# EAGLE design KGGR_M2_MOS (EAGLE 9.4.2)
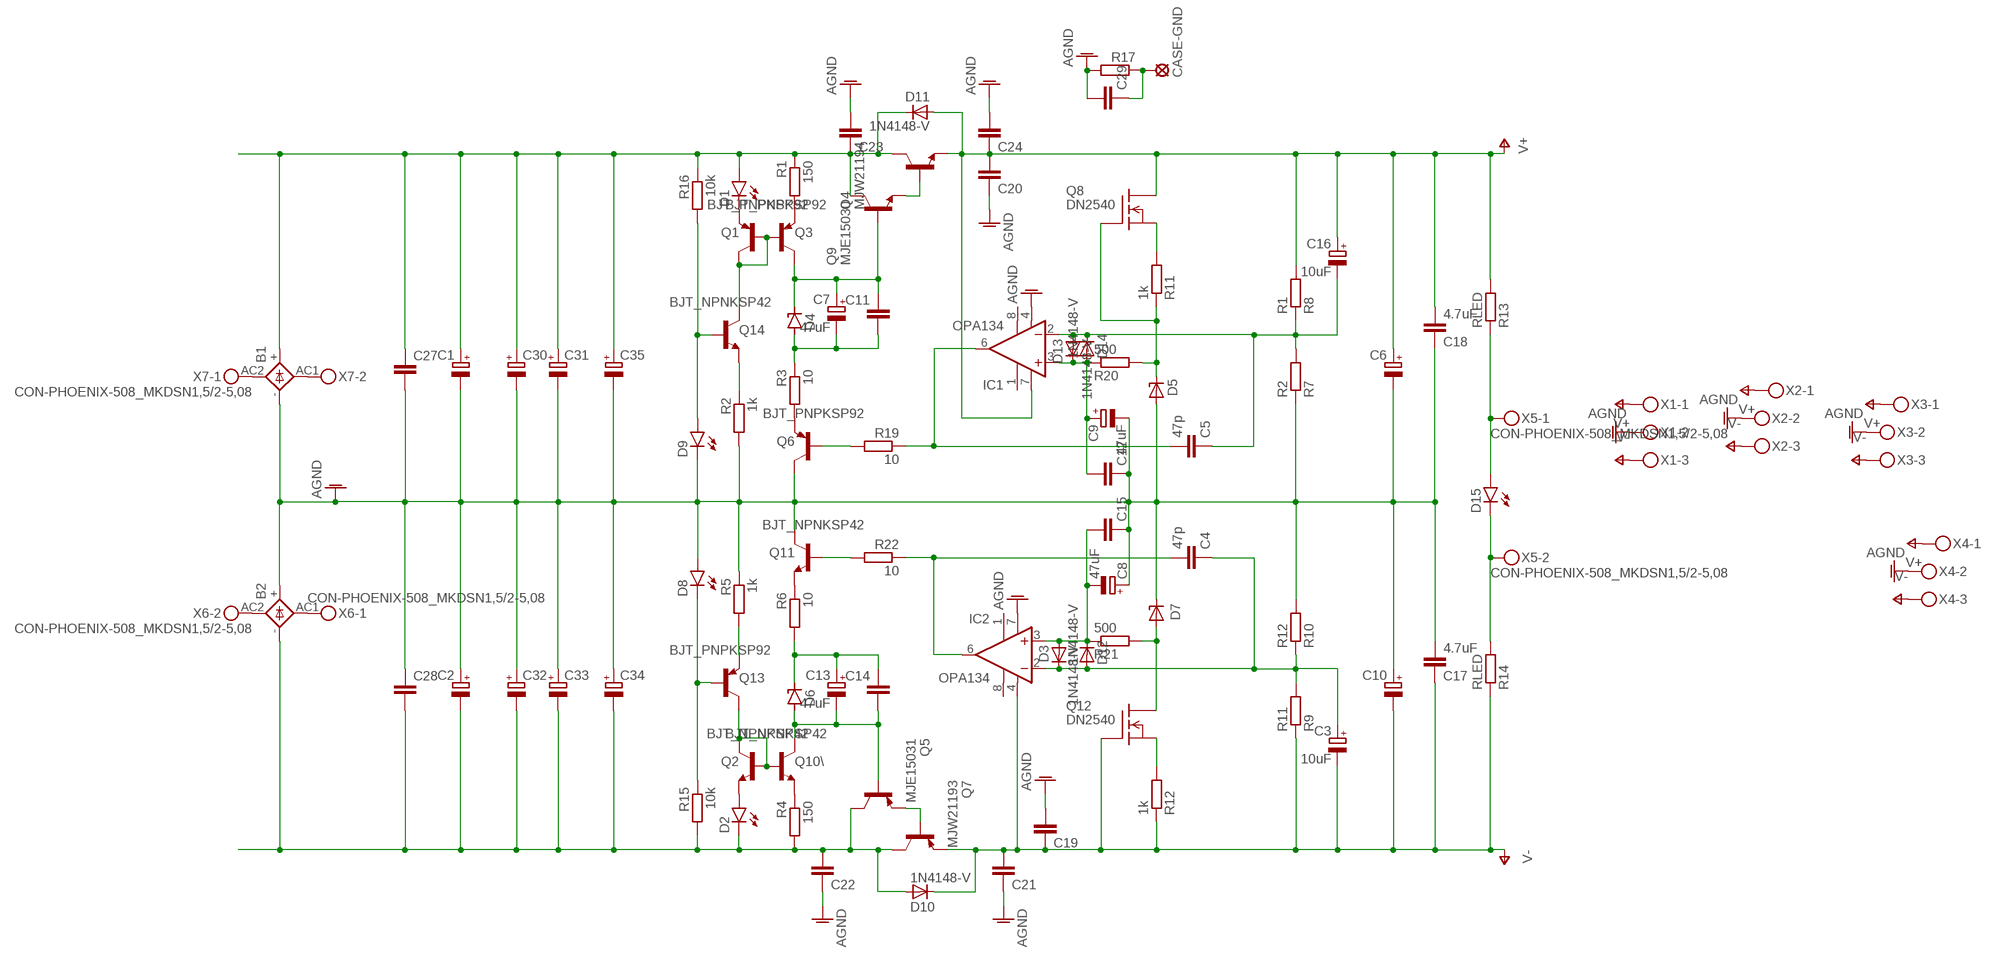
[diagram p0: schematic, sheet 1]

## Parts
B1  GBU4  [GBU4S]
B2  GBU4  [GBU4S]
C1  CPOL-EUE10-35  [EB35D]
C2  CPOL-EUE10-35  [EB35D]
C3  10uF  CPOL-EUE5-8.5  [E5-8,5]
C4  47p  C-EU025_050-025X075  [C025_050-025X075]
C5  47p  C-EU025_050-025X075  [C025_050-025X075]
C6  CPOL-EUE7.5-18  [E7,5-18]
C7  47uF  CPOL-EUE5-8.5  [E5-8,5]
C8  47uF  CPOL-EUE5-8.5  [E5-8,5]
C9  47uF  CPOL-EUE5-8.5  [E5-8,5]
C10  CPOL-EUE7.5-18  [E7,5-18]
C11  C-EU050-035X075  [C050-035X075]
C12  C-EU050-035X075  [C050-035X075]
C13  47uF  CPOL-EUE5-8.5  [E5-8,5]
C14  C-EU050-035X075  [C050-035X075]
C15  C-EU050-035X075  [C050-035X075]
C16  10uF  CPOL-EUE5-8.5  [E5-8,5]
C17  4.7uF  C-EU050-075X075  [C050-075X075]
C18  4.7uF  C-EU050-075X075  [C050-075X075]
C19  C-EU050-035X075  [C050-035X075]
C20  C-EU050-035X075  [C050-035X075]
C21  C-EU050-035X075  [C050-035X075]
C22  C-EU050-075X075  [C050-075X075]
C23  C-EU050-075X075  [C050-075X075]
C24  C-EU050-035X075  [C050-035X075]
C27  C-EU102_152-062X184  [C102_152-062X184]
C28  C-EU102_152-062X184  [C102_152-062X184]
C29  C-EU102_152-062X184  [C102_152-062X184]
C30  CPOL-EUE7.5-18  [E7,5-18]
C31  CPOL-EUE7.5-18  [E7,5-18]
C32  CPOL-EUE7.5-18  [E7,5-18]
C33  CPOL-EUE7.5-18  [E7,5-18]
C34  CPOL-EUE7.5-18  [E7,5-18]
C35  CPOL-EUE7.5-18  [E7,5-18]
CASE-GND  SE14  [SE14]
D1  LED5MM  [LED5MM]
D2  LED5MM  [LED5MM]
D3  1N4148-V  [1N4148]
D4  1N4728  [DO41Z10]
D5  LT1021  LT1021-V  [DIL08]
D6  1N4728  [DO41Z10]
D7  LT1021  LT1021-V  [DIL08]
D8  LED5MM  [LED5MM]
D9  LED5MM  [LED5MM]
D10  1N4148-V  [1N4148]
D11  1N4148-V  [1N4148]
D12  1N4148-V  [1N4148]
D13  1N4148-V  [1N4148]
D14  1N4148-V  [1N4148]
D15  LED5MM  [LED5MM]
IC1  OPA134  OPA134P  [DIL08]
IC2  OPA134  OPA134P  [DIL08]
Q1  BJT_PNPKSP92  [TRANSISTOR_TO92-EBC_P]
Q2  BJT_NPNKSP42  [TRANSISTOR_TO92-EBC_N]
Q3  BJT_PNPKSP92  [TRANSISTOR_TO92-EBC_P]
Q4  MJW21194  BJT_NPNMJL4281  [TRANSISTOR_TO247_BCE_N]
Q5  MJE15031  [TO220KG]
Q6  BJT_PNPKSP92  [TRANSISTOR_TO92-EBC_P]
Q7  MJW21193  BJT_PNPMJL4302  [TRANSISTOR_TO247_BCE_P]
Q8  DN2540  2N7000  [TO92-]
Q9  MJE15030  [TO220KG]
Q10\  BJT_NPNKSP42  [TRANSISTOR_TO92-EBC_N]
Q11  BJT_NPNKSP42  [TRANSISTOR_TO92-EBC_N]
Q12  DN2540  2N7000  [TO92-]
Q13  BJT_PNPKSP92  [TRANSISTOR_TO92-EBC_P]
Q14  BJT_NPNKSP42  [TRANSISTOR_TO92-EBC_N]
R1  150  R-EU_0309/12  [0309/12]
R2  1k  R-EU_0309/12  [0309/12]
R3  10  R-EU_0309/12  [0309/12]
R4  150  R-EU_0309/12  [0309/12]
R5  1k  R-EU_0309/12  [0309/12]
R6  10  R-EU_0309/12  [0309/12]
R7  R2  R-EU_0309/12  [0309/12]
R8  R1  R-EU_0309/12  [0309/12]
R9  R11  R-EU_0309/12  [0309/12]
R10  R12  R-EU_0309/12  [0309/12]
R11  1k  R-EU_0309/12  [0309/12]
R12  1k  R-EU_0309/12  [0309/12]
R13  RLED  R-EU_0309/12  [0309/12]
R14  RLED  R-EU_0309/12  [0309/12]
R15  10k  R-EU_0309/12  [0309/12]
R16  10k  R-EU_0309/12  [0309/12]
R17  R-EU_0617/22  [0617/22]
R19  10  R-EU_0309/12  [0309/12]
R20  500  R-EU_0309/12  [0309/12]
R21  500  R-EU_0309/12  [0309/12]
R22  10  R-EU_0309/12  [0309/12]
X1  CON-PHOENIX-508_MKDSN1,5/3-5,08  [CON-PHOENIX-508_MKDSN1,5/3-5,08]
X2  CON-PHOENIX-508_MKDSN1,5/3-5,08  [CON-PHOENIX-508_MKDSN1,5/3-5,08]
X3  CON-PHOENIX-508_MKDSN1,5/3-5,08  [CON-PHOENIX-508_MKDSN1,5/3-5,08]
X4  CON-PHOENIX-508_MKDSN1,5/3-5,08  [CON-PHOENIX-508_MKDSN1,5/3-5,08]
X5  CON-PHOENIX-508_MKDSN1,5/2-5,08  [CON-PHOENIX-508_MKDSN1,5/2-5,08]
X6  CON-PHOENIX-508_MKDSN1,5/2-5,08  [CON-PHOENIX-508_MKDSN1,5/2-5,08]
X7  CON-PHOENIX-508_MKDSN1,5/2-5,08  [CON-PHOENIX-508_MKDSN1,5/2-5,08]

## Nets
AGND: B1.- B2.+ C1.- C2.+ C6.- C8.+ C9.- C10.+ C12.1 C15.1 C17.2 C18.1 C19.2 C20.1 C21.1 C22.1 C23.2 C24.2 C27.2 C27.3 C28.1 C29.2 C29.3 C30.- C31.- C32.+ C33.+ C34.+ C35.- D5.4(GND) D7.6(OUT) D8.A D9.K(C) IC1.4(V-) IC2.7(V+) Q6.C Q11.C R2.2 R5.1 R7.1 R10.2 R17.2 X1.2 X2.2 X3.2 X4.2
N$1: Q1.B Q1.C Q3.B Q14.C
N$2: D1.K(C) Q1.E
N$3: Q3.E R1.2
N$4: B1.+ C1.+ C23.1 C27.1 C30.+ C31.+ C35.+ D1.A D11.C Q4.C Q9.2(C) R1.1 R16.1
N$5: C7.+ C11.1 D4.C Q3.C Q9.1(B)
N$6: C7.- C11.2 D4.A R3.1
N$7: Q6.E R3.2
N$8: Q14.E R2.1
N$9: D9.A Q14.B R16.2
N$10: C8.- C15.2 D3.A D12.C IC2.3(+IN) R21.1
N$11: Q13.E R5.2
N$12: D8.K(C) Q13.B R15.1
N$13: Q11.E R6.1
N$14: C13.+ C14.1 D6.C R6.2
N$15: C13.- C14.2 D6.A Q5.1(B) Q10\.C
N$16: Q2.B Q2.C Q10\.B Q13.C
N$17: Q5.3(E) Q7.B
N$18: Q10\.E R4.1
N$19: D2.A Q2.E
N$21: Q4.B Q9.3(E)
N$22: B2.- C2.- C22.2 C28.2 C28.3 C32.- C33.- C34.- D2.K(C) D10.A Q5.2(C) Q7.C R4.2 R15.2
N$23: B1.AC2(AC1) X7.1
N$24: C5.2 C5.3 IC1.6(OUT) R19.1
N$25: C4.2 C4.3 IC2.6(OUT) R22.1
N$26: Q11.B R22.2
N$27: Q6.B R19.2
N$28: C5.1 C16.- D13.A D14.C IC1.2(-IN) R7.2 R8.1
N$29: Q12.3(S) R12.2
N$30: D5.6(OUT) Q8.2(G) R11.1 R20.2
N$31: C9.+ C12.2 D13.C D14.A IC1.3(+IN) R20.1
N$32: D15.K(C) R14.2 X5.2
N$33: D7.4(GND) Q12.1(D) R21.2
N$34: C3.+ C4.1 D3.C D12.A IC2.2(-IN) R9.2 R10.1
N$35: Q8.3(S) R11.2
N$36: D15.A R13.1 X5.1
N$38: B1.AC1(AC2) X7.2
N$41: C29.1 CASE-GND.MP R17.1
N$42: B2.AC2(AC1) X6.2
N$43: B2.AC1(AC2) X6.1
V+: C6.+ C16.+ C18.2 C20.2 C24.1 D11.A IC1.7(V+) Q4.E Q8.1(D) R8.2 R13.2 X1.1 X2.1 X3.1 X4.1
V-: C3.- C10.- C17.1 C19.1 C21.2 D10.C IC2.4(V-) Q7.E Q12.2(G) R9.1 R12.1 R14.1 X1.3 X2.3 X3.3 X4.3
Unconnected: IC1.1(TRIM1) IC1.8(TRIM2) IC2.1(TRIM1) IC2.8(TRIM2)

## Library data of the parts
B1 B2 = Vwvwbg:GBU4: GENERAL INSTRUMENT RECTIFIER
C1-C3 C6-C10 C13 C16 C30-C35 = Vwvwbg:CPOL-EU: POLARIZED CAPACITOR, European symbol
C4 C5 C11 C12 C14 C15 C17-C24 C27-C29 = Vwvwbg:C-EU: CAPACITOR, European symbol
CASE-GND = solpad:SE14: SOLDER PAD E1553, drill 1,4mm, distributor Buerklin, 07F820
D1 D2 D8 D9 D15 = led:LED: LED OSRAM: - CHIPLED LG R971, LG N971, LY N971, LG Q971, LY Q971, LO R971, LY R971 LH N974, LH R974 LS Q976, LO Q976, LY Q976 LO Q996 - Hyper CHIPLED LW Q18S LB Q993, LB Q99A, LB R99A - SideLED LS A670, LO A670, LY A670, LG A670, LP A670 LB A673, LV A673, LT A673, LW A673 LH A674 LY A675 LS A676, LA A676, LO A676, LY A676, LW A676 LS A679, LY A679, LG A679 - Hyper Micro SIDELED® LS Y876, LA Y876, LO Y876, LY Y876 LT Y87S - SmartLED LW L88C, LW L88S LB L89C, LB L89S, LG L890 LS L89K, LO L89K, LY L89K LS L896, LA L896, LO L896, LY L896 - TOPLED LS T670, LO T670, LY T670, LG T670, LP T670 LSG T670, LSP T670, LSY T670, LOP T670, LYG T670 LG T671, LOG T671, LSG T671 LB T673, LV T673, LT T673, LW T673 LH T674 LS T676, LA T676, LO T676, LY T676, LB T676, LH T676, LSB T676, LW T676 LB T67C, LV T67C, LT T67C, LS T67K, LO T67K, LY T67K, LW E67C LS E67B, LA E67B, LO E67B, LY E67B, LB E67C, LV E67C, LT E67C LW T67C LS T679, LY T679, LG T679 LS T770, LO T770, LY T770, LG T770, LP T770 LB T773, LV T773, LT T773, LW T773 LH T774 LS E675, LA E675, LY E675, LS T675 LS T776, LA T776, LO T776, LY T776, LB T776 LHGB T686 LT T68C, LB T68C - Hyper Mini TOPLED® LB M676 - Mini TOPLED Santana® LG M470 LS M47K, LO M47K, LY M47K Source: http://www.osram.convergy.de LUXEON: - LUMILED® LXK2-PW12-R00, LXK2-PW12-S00, LXK2-PW14-U00, LXK2-PW14-V00 LXK2-PM12-R00, LXK2-PM12-S00, LXK2-PM14-U00 LXK2-PE12-Q00, LXK2-PE12-R00, LXK2-PE12-S00, LXK2-PE14-T00, LXK2-PE14-U00 LXK2-PB12-K00, LXK2-PB12-L00, LXK2-PB12-M00, LXK2-PB14-N00, LXK2-PB14-P00, LXK2-PB14-Q00 LXK2-PR12-L00, LXK2-PR12-M00, LXK2-PR14-Q00, LXK2-PR14-R00 LXK2-PD12-Q00, LXK2-PD12-R00, LXK2-PD12-S00 LXK2-PH12-R00, LXK2-PH12-S00 LXK2-PL12-P00, LXK2-PL12-Q00, LXK2-PL12-R00 Source: www.luxeon.com KINGBRIGHT: KA-3528ASYC Source: www.kingbright.com
D3 D10-D14 = diode:1N4148-V
D4 D6 = diode:1N4728: Z DIODE 3.3 V, 1W, 5 percent
D5 D7 = linear-technology:LT1021-V
IC1 IC2 = burr-brown:OPA134: Operational Amplifiers SoundPlus(TM) High Performance Audio; MF: TEXAS INSTRUMENTS; MPN: OPA134PA; OC_FARNELL: 1335032; OC_NEWARK: 75C4599
Q1 Q3 Q6 Q7 Q13 = Vwvwbg:BJT_PNP
Q2 Q4 Q10\ Q11 Q14 = Vwvwbg:BJT_NPN
Q5 = transistor:MJE15031
Q8 Q12 = tranzistory FET:2N7000
Q9 = transistor:MJE15030
R1-R17 R19-R22 = Vwvwbg:R-EU_: RESISTOR, European symbol
X1-X4 = Vwvwbg:CON-PHOENIX-508_MKDSN1,5/3-5,08: MKDSN 1,5/ 3-5,08 Printklemme Nennstrom: 13,5 A Nennspannung: 250 V Rastermaß: 5,08 mm Polzahl: 3 Anschlussart: Schraubanschluss Montage: Löten Anschlussrichtung Leiter/Platine: 0 ° Artikelnummer: 1729131 Source: http://eshop.phoenixcontact.com .. 1729131.pdf
X5-X7 = Vwvwbg:CON-PHOENIX-508_MKDSN1,5/2-5,08: MKDSN 1,5/ 2-5,08 Printklemme Nennstrom: 13,5 A Nennspannung: 250 V Rastermaß: 5,08 mm Polzahl: 2 Anschlussart: Schraubanschluss Montage: Löten Anschlussrichtung Leiter/Platine: 0 ° Artikelnummer: 1729128 Source: http://eshop.phoenixcontact.com .. 1729128.pdf

## Board
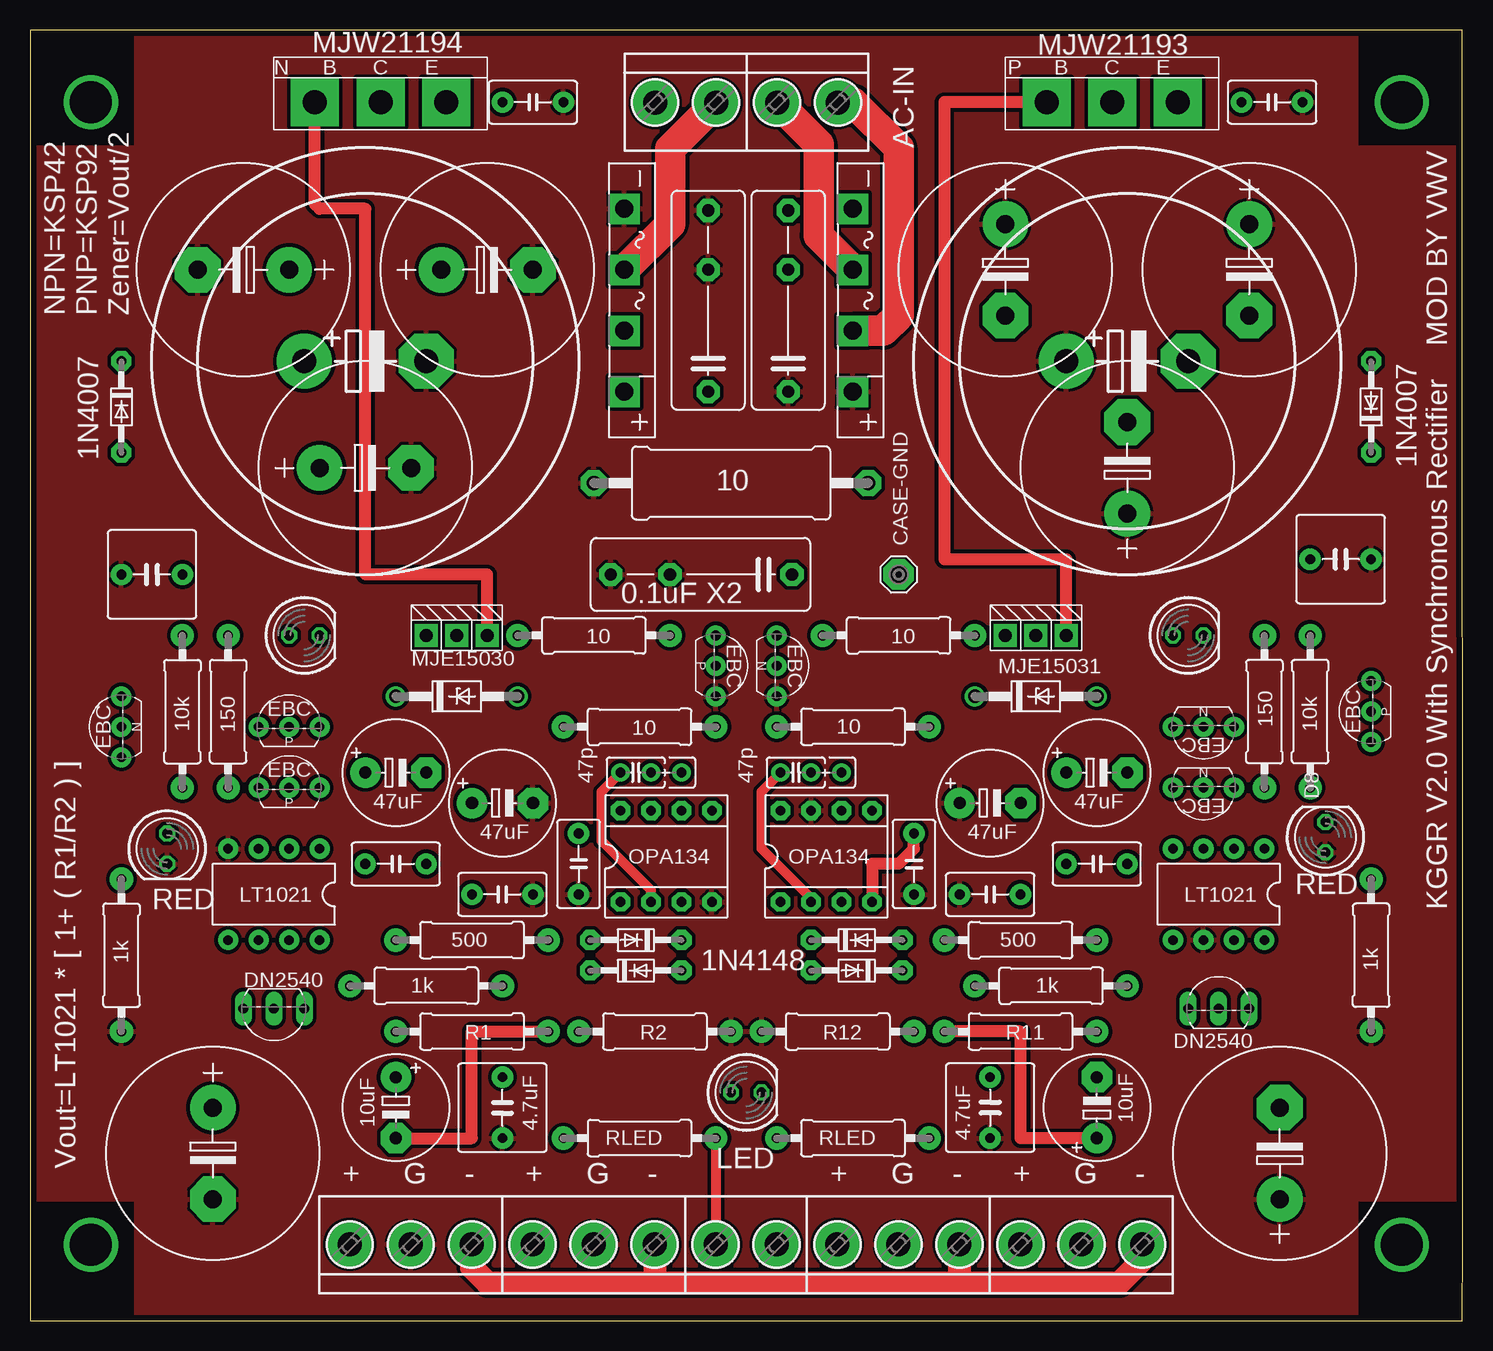
[diagram p1: board, top side]
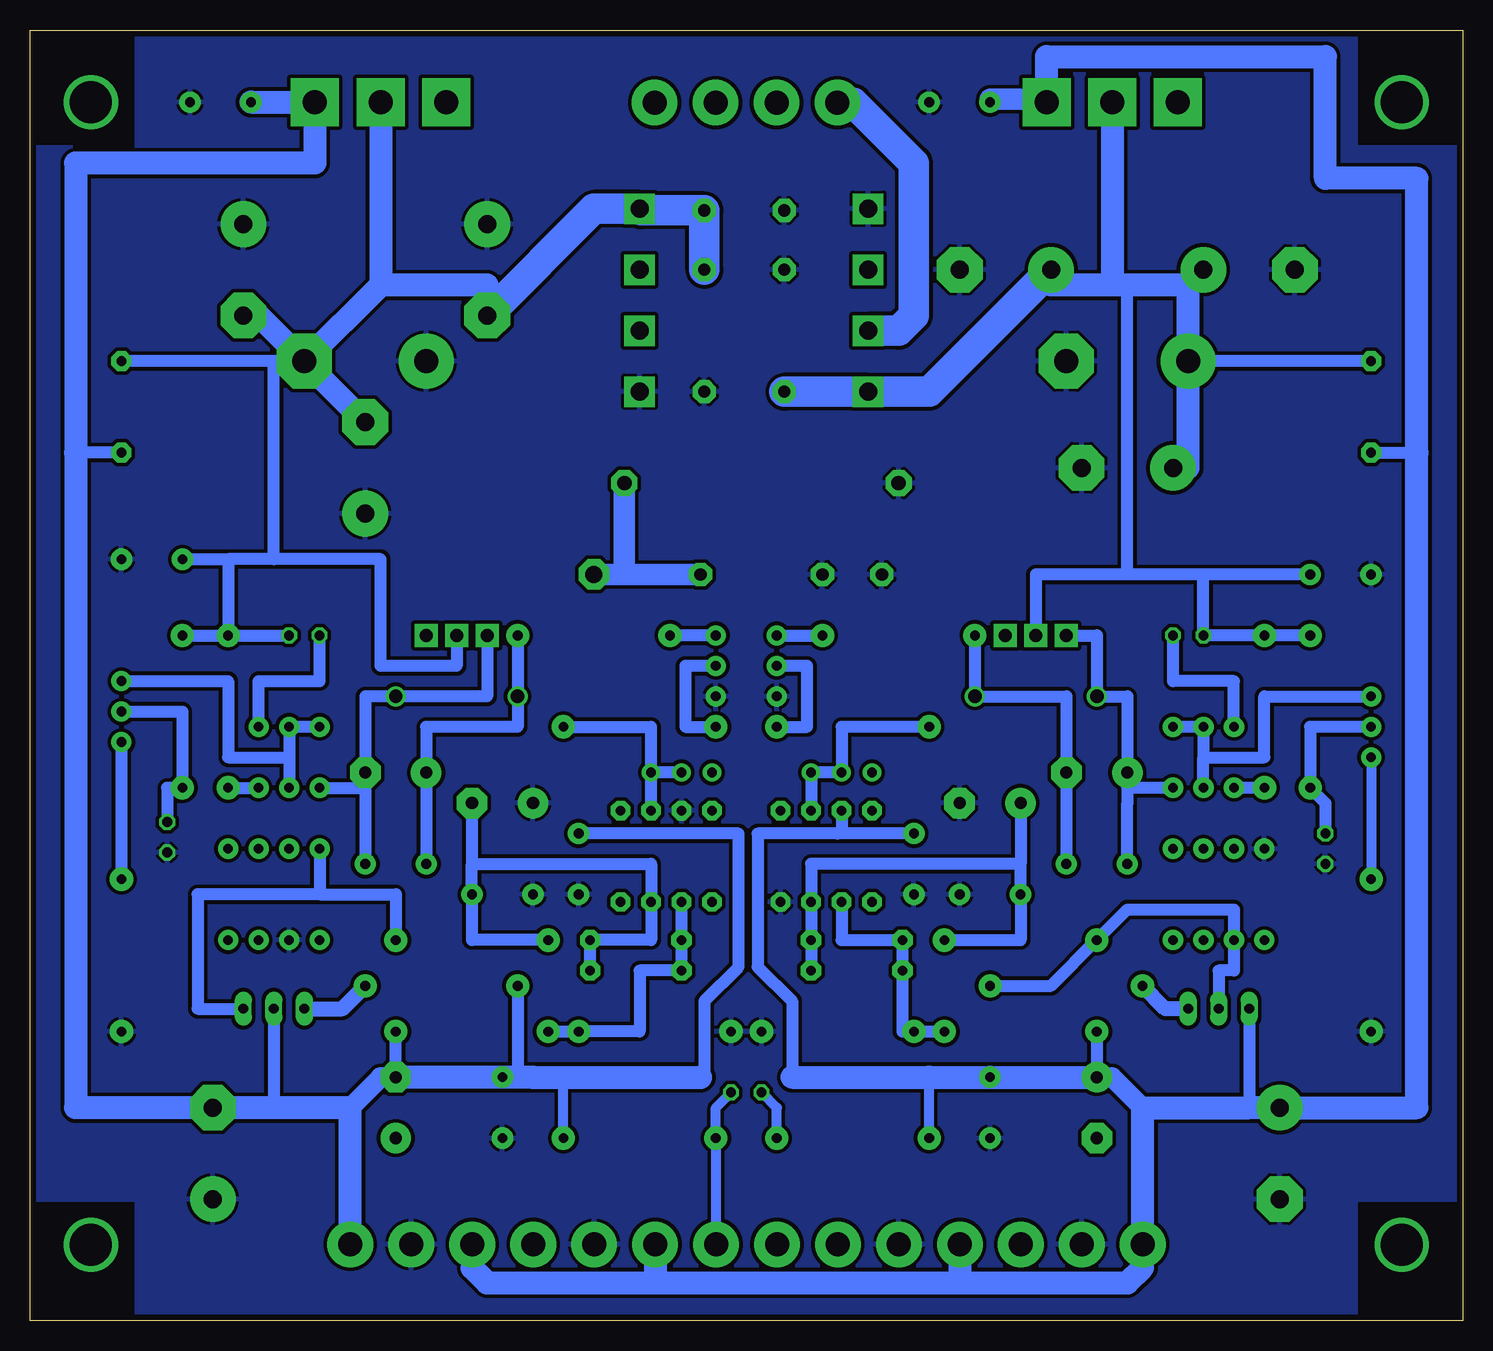
[diagram p2: board, bottom side, seen from below]

Size 119.38 x 107.62 mm. Coordinates in mm from the lower left corner, seen from the top.
Outline: 0,0 119.36,0 119.38,6.35 119.36,107.62 0,107.62 0,0
Copper layers (1*16): Top 0.035mm / dielectric 1.5mm / Bottom 0.035mm
Design rules "default *": minimum track width 10mil, minimum drill 24mil, track to track 12mil, track to pad 12mil, pad to pad 8mil, via to via 8mil, smd to smd 8mil, copper to edge 20mil, drill to drill 8mil, minimum pad ring 10mil, minimum via ring 8mil, stop-mask expansion 4mil, vias tented up to drill 0mil, thermal gap 10mil

### Footprints (pad centres in the part's own frame; a part is rotated, then mirrored left to right if it is on the bottom)
GBU4S = drill 1.499 pad 2.54 square: + 7.62,0; - -7.62,0; AC1 2.54,0; AC2 -2.54,0
EB35D = drill 2.007 pad 4.597: + -5.08,0 | drill 2.007 pad 4.597 octagon: - 5.08,0
E5-8,5 = drill 1.016 pad 2.54: + -2.54,0 | drill 1.016 pad 2.54 octagon: - 2.54,0
C025_050-025X075 = drill 0.813 pad 1.524: 1 -1.27,0; 2 1.27,0; 3 3.81,0
E7,5-18 = drill 1.5 pad 3.81: + -3.81,0 | drill 1.5 pad 3.81 octagon: - 3.81,0
C050-035X075 = drill 0.813 pad 1.778: 1 -2.54,0; 2 2.54,0
C050-075X075 = drill 0.813 pad 1.778: 1 -2.54,0; 2 2.54,0
C102_152-062X184 = drill 1.016 pad 1.93 octagon: 1 -5.08,0; 2 5.08,0; 3 10.033,0
SE14 = drill 1.397 pad 2.54 octagon: MP 0,0
LED5MM = drill 0.813 octagon: A -1.27,0; K 1.27,0
1N4148 = drill 0.813 pad 1.676 octagon: A 3.81,0; C -3.81,0
DO41Z10 = drill 1.118: A 5.08,0; C -5.08,0
DIL08 = drill 0.813 pad 1.676: 1 -3.81,-3.81; 2 -1.27,-3.81; 3 1.27,-3.81; 4 3.81,-3.81; 5 3.81,3.81; 6 1.27,3.81; 7 -1.27,3.81; 8 -3.81,3.81
DIL08' = drill 0.813 pad 1.6 octagon: 1 -3.81,-3.81; 2 -1.27,-3.81; 3 1.27,-3.81; 4 3.81,-3.81; 5 3.81,3.81; 6 1.27,3.81; 7 -1.27,3.81; 8 -3.81,3.81
TRANSISTOR_TO92-EBC_P = drill 0.813 pad 1.676: B 0,0; C 2.54,0; E -2.54,0
TRANSISTOR_TO92-EBC_N = drill 0.813 pad 1.676: B 0,0; C 2.54,0; E -2.54,0
TRANSISTOR_TO247_BCE_N = drill 2 pad 4 square: B -5.461,0; C 0,0; E 5.461,0
TO220KG = drill 1.1 pad 1.93 square: 1 -2.54,0; 2 0,0; 3 2.54,0
TRANSISTOR_TO247_BCE_P = drill 2 pad 4 square: B -5.461,0; C 0,0; E 5.461,0
TO92- = drill 0.813 pad 1.422 long: 1 2.54,0; 2 0,0; 3 -2.54,0
0309/12 = drill 0.813 pad 1.93: 1 -6.35,0; 2 6.35,0
0617/22 = drill 1.2 pad 2.184 octagon: 1 -11.43,0; 2 11.43,0
CON-PHOENIX-508_MKDSN1,5/3-5,08 = drill 2 pad 3.81: 1 -7.641,0.025; 2 -2.561,0.025; 3 2.519,0.025
CON-PHOENIX-508_MKDSN1,5/2-5,08 = drill 2 pad 3.81: 1 -2.561,0.025; 2 2.519,0.025

### Placement (x,y rotation side)
B1  49.53,85.09 270 top
B2  68.58,85.09 270 top
C1  27.94,80.01 0 top
C2  91.44,80.01 0 top
C3  88.9,17.78 90 top
C4  63.82,45.72 0 top
C5  50.48,45.72 0 top
C6  15.24,13.97 270 top
C7  30.48,45.72 0 top
C8  80.01,43.18 0 top
C9  39.37,43.18 0 top
C10  104.14,13.97 90 top
C11  30.48,38.1 0 top
C12  39.37,35.56 180 top
C13  88.9,45.72 0 top
C14  88.9,38.1 0 top
C15  80.01,35.56 0 top
C16  30.48,17.78 270 top
C17  80.01,17.78 270 top
C18  39.37,17.78 90 top
C19  73.66,38.1 270 top
C20  45.72,38.1 90 top
C21  103.5,101.6 180 top
C22  109.22,63.5 180 top
C23  10.16,62.23 180 top
C24  41.91,101.6 0 top
C27  56.52,82.55 90 top
C28  63.18,82.55 90 top
C29  58.42,62.23 180 top
C30  17.78,87.63 180 top
C31  38.1,87.63 0 top
C32  81.28,87.63 270 top
C33  101.6,87.63 270 top
C34  91.44,71.12 90 top
C35  27.94,71.12 0 top
CASE-GND  72.39,62.23 0 top
D1  22.86,57.15 0 top
D2  96.52,57.15 0 top
D3  68.9,31.75 0 top
D4  35.56,52.07 0 top
D5  20.32,35.56 180 top
D6  83.82,52.07 0 top
D7  99.06,35.56 180 top
D8  107.95,40.32 90 top
D9  11.43,39.37 270 top
D10  111.76,76.2 90 top
D11  7.62,76.2 270 top
D12  68.9,29.21 180 top
D13  50.48,31.75 180 top
D14  50.48,29.21 0 top
D15  59.69,19.05 0 top
IC1  OPA134  [DIL08']  53.02,38.73 0 top
IC2  OPA134  [DIL08']  66.36,38.73 0 top
Q1  21.59,49.53 0 top
Q2  97.79,49.53 180 top
Q3  21.59,44.45 0 top
Q4  29.21,101.6 0 top
Q5  83.82,57.15 0 top
Q6  57.15,54.61 270 top
Q7  90.17,101.6 0 top
Q8  20.32,26.04 180 top
Q9  35.56,57.15 0 top
Q10\  97.79,44.45 180 top
Q11  62.23,54.61 270 top
Q12  99.06,26.04 0 top
Q13  111.76,50.8 90 top
Q14  7.62,49.53 90 top
R1  16.51,50.8 270 top
R2  7.62,30.48 270 top
R3  46.99,57.15 0 top
R4  102.87,50.8 90 top
R5  111.76,30.48 90 top
R6  72.39,57.15 0 top
R7  52.07,24.13 180 top
R8  36.83,24.13 180 top
R9  82.55,24.13 180 top
R10  67.31,24.13 180 top
R11  33.02,27.94 180 top
R12  85.09,27.94 0 top
R13  50.8,15.24 180 top
R14  68.58,15.24 180 top
R15  106.68,50.8 90 top
R16  12.7,50.8 270 top
R17  58.42,69.85 180 top
R19  50.8,49.53 0 top
R20  36.83,31.75 180 top
R21  82.55,31.75 0 top
R22  68.58,49.53 180 top
X1  90.17,6.35 0 top
X2  74.93,6.35 0 top
X3  49.53,6.35 0 top
X4  34.29,6.35 0 top
X5  59.69,6.35 0 top
X6  64.77,101.6 180 top
X7  54.61,101.6 180 top

### Tracks (layer width: path | path; a pad name or v marks a point on that pad's centre or on a via)
AGND
  pour Top: 8.89,107.95 110.49,107.95 110.49,97.79 119.38,97.79 119.38,10.16 110.49,10.16 110.49,0 8.89,0 8.89,10.16 0,10.16 0,97.79 8.89,97.79
  pour Bottom: 0,97.79 8.89,97.79 8.89,107.95 110.49,107.95 110.49,97.79 119.38,97.79 119.38,10.16 110.49,10.16 110.49,0 8.89,0 8.89,10.16 0,10.16
N$1
  Bottom 1.016: Q3.B 21.59,46.99 | 21.59,46.99 16.51,46.99 16.51,52.07 Q14.C | 21.59,46.99 Q1.B Q1.C
N$2
  Bottom 1.016: Q1.E 19.05,53.34 24.13,53.34 D1.K
N$3
  Bottom 1.016: R1.2 Q3.E
N$4
  Bottom 1.016: R16.1 R1.1 D1.A 21.59,62.23 | Q9.2 35.56,62.23 27.94,62.23 | D11.C C1.+ | 21.59,62.23 27.94,62.23 | C23.1 21.59,62.23 | 27.94,62.23 27.94,86.36
  Bottom 1.93: 22.86,86.36 C1.+ 22.86,71.12 C35.+ | 22.86,86.36 27.94,86.36 29.21,86.36 | 29.21,86.36 34.29,86.36 C31.+ | Q4.C 29.21,86.36 | C30.+ 22.86,86.36
  Bottom 2.54: C31.+ 44.45,77.47 B1.+ C27.1
N$5
  Bottom 1.016: Q9.1 30.48,57.15 D4.C 27.94,52.07 C7.+ 27.94,44.45 | 27.94,44.45 27.94,43.18 C11.1 | Q3.C 27.94,44.45
N$6
  Bottom 1.016: R3.1 D4.A 33.02,52.07 C7.- C11.2
N$7
  Bottom 1.016: Q6.E R3.2
N$8
  Bottom 0.813: Q14.E R2.1
N$9
  Bottom 1.016: D9.A 11.43,43.18 R16.2 12.7,49.53 Q14.B
N$10
  Bottom 1.016: C8.- 82.55,38.1 | D12.C D3.A 67.63,31.75 IC2.3 67.63,38.1 82.55,38.1 | R21.1 82.55,31.75 C15.2 82.55,38.1
N$11
  Bottom 1.016: Q13.E R5.2
N$12
  Bottom 1.016: Q13.B 106.68,50.8 R15.1 107.95,44.45 D8.K
N$13
  Bottom 1.016: Q11.E R6.1
N$14
  Bottom 1.016: R6.2 D6.C 78.74,49.53 86.36,49.53 C13.+ C14.1
N$15
  Bottom 1.016: Q5.1 81.28,52.07 D6.A 91.44,52.07 C13.- 91.44,44.45 | 91.44,44.45 C14.2 | Q10\.C 91.44,44.45
N$16
  Bottom 1.016: 97.79,46.99 Q2.B Q2.C | 97.79,46.99 Q10\.B | Q13.C 102.87,53.34 102.87,46.99 97.79,46.99
N$17
  Top 1.016: Q5.3 86.36,63.5 76.2,63.5 76.2,101.6 Q7.B
N$18
  Bottom 1.016: R4.1 Q10\.E
N$19
  Bottom 1.016: Q2.E 100.33,53.34 95.25,53.34 D2.A
N$20  (via drill 3.5)
  other vias: 5.08,101.6
N$21
  Top 1.016: Q9.3 38.1,62.23 27.94,62.23 27.94,92.71 24.13,92.71 23.75,93.09 Q4.B
N$22
  Bottom 1.016: C2.- 99.06,80.01 | 99.06,80.01 D10.A | R15.2 R4.2 | R4.2 D2.K | Q5.2 83.82,54.61 90.17,54.61 90.17,63.5 99.06,63.5 | 99.06,63.5 102.87,63.5 | 102.87,63.5 R4.2 | 99.06,63.5 99.06,80.01 | C22.2 102.87,63.5
  Bottom 1.93: C2.- 90.17,86.36 | 90.17,86.36 81.28,86.36 C32.- | C33.- 100.33,83.82 C2.- | C34.- C2.- | Q7.C 90.17,86.36
  Bottom 2.54: C28.2 C28.3 68.45,92.58 B2.- 72.39,92.71 C32.-
N$23
  Top 2.54: X7.1 53.34,97.74 53.34,91.44 B1.AC2
N$24
  Bottom 1.016: R19.1 51.75,49.53 C5.2 C5.3 IC1.6
N$25
  Bottom 1.016: R22.1 67.63,49.53 C4.3 | C4.2 C4.3 | IC2.6 C4.3
N$26
  Bottom 1.016: Q11.B 64.77,54.61 64.77,49.53 R22.2
N$27
  Bottom 1.016: R19.2 54.61,49.53 54.61,54.61 Q6.B
N$28
  Top 0.813: IC1.2 51.75,35.88 47.62,40.01 47.62,44.13 C5.1
  Top 1.016: C16.- 36.83,15.24 36.83,24.13 R8.1
  Bottom 1.016: IC1.2 51.75,31.75 D13.A D14.C 46.67,24.13 R7.2 R8.1
N$29
  Bottom 1.27: Q12.3 93.34,26.04 R12.2
N$30
  Bottom 1.016: Q8.2 20.32,29.21 19.05,29.21 D5.6 19.05,34.29 27.94,34.29 R20.2 34.29,27.94 R11.1
N$31
  Bottom 1.016: D14.A D13.C IC1.3 54.29,38.1 36.83,38.1 | C9.+ 36.83,38.1 | R20.1 36.83,31.75 C12.2 36.83,38.1
N$32
  Bottom 0.813: D15.K 62.23,17.78 R14.2 62.21,15.22 X5.2
N$33
  Bottom 1.016: D7.4 95.25,35.56 | 95.25,35.56 88.9,35.56 R21.2 | 95.25,35.56 105.41,35.56 105.41,26.04 Q12.1
N$34
  Top 0.813: IC2.2 65.09,35.24 60.96,39.37 60.96,44.13 C4.1
  Top 1.016: C3.+ 82.55,15.24 82.55,24.13 R9.2
  Bottom 1.016: IC2.2 D3.C D12.A 68.58,29.21 68.58,24.13 R10.1 R9.2
N$35
  Bottom 1.27: Q8.3 24.77,26.04 R11.2
N$36
  Top 0.813: R13.1 57.15,6.4 X5.1
  Bottom 0.813: R13.1 57.15,17.78 D15.A
N$37  (via drill 3.5 pad 1.1)
  other vias: 5.08,6.35
N$38
  Bottom 2.54: X7.2 50.77,101.58 45.72,96.52 45.72,83.82 46.99,82.55 B1.AC1
N$39  (via drill 3.5)
  other vias: 114.3,6.35
N$40  (via drill 3.5)
  other vias: 114.3,101.6
N$41
  Bottom 1.27: C29.1 69.85,62.23
  Bottom 1.778: R17.1 69.85,62.23 | CASE-GND.MP C29.1
N$42
  Top 2.54: X6.2 65.72,98.1 65.72,90.49 B2.AC2
N$43
  Top 2.54: X6.1 68.61,101.58 72.39,97.79 72.39,83.82 71.12,82.55 B2.AC1
V+
  Bottom 0.813: R13.2 44.45,20.32
  Bottom 1.016: R8.2 C16.+ | Q8.1 17.78,17.78 | D11.A 3.81,72.39 | Q4.E 34.67,101.85 | C20.2 52.07,40.64 | 52.07,40.64 58.74,40.64 58.74,29.53 55.88,26.67 55.88,20.32 | IC1.7 51.75,40.96 52.07,40.64
  Bottom 1.676: C16.+ 29.21,20.32 26.67,17.78
  Bottom 1.778: 34.67,101.85 39.37,101.85 C24.1
  Bottom 1.93: C16.+ C18.2 44.45,20.32 55.88,20.32 | X3.1 41.89,3.2 41.91,3.17 | 41.91,3.17 27.94,3.17 26.67,4.45 26.67,6.35 X4.1 26.67,7.64 26.67,17.78 17.78,17.78 C6.+ 3.81,17.78 3.81,72.39 3.81,95.25 11.43,95.25 11.43,105.41 34.67,105.41 Q4.E | X2.1 67.29,3.2 67.31,3.17 | 67.31,3.17 81.28,3.17 82.53,4.42 X1.1 | 67.31,3.17 41.91,3.17
V-
  Top 1.016: C19.1 73.66,39.37 72.39,38.1 70.17,38.1 IC2.4
  Top 1.93: X4.3 36.81,4.47 38.1,3.17 52.07,3.17 | 52.07,3.17 77.47,3.17 | 77.47,3.17 90.81,3.17 92.71,5.08 92.71,6.35 X1.3 | X2.3 77.45,3.2 77.47,3.17 | X3.3 52.05,3.2 52.07,3.17
  Bottom 0.813: R14.1 74.93,20.3
  Bottom 1.016: 77.45,20.3 77.47,20.32 | Q12.2 99.06,17.78 | C3.- R9.1 | D10.C 115.57,72.39 | R12.1 78.74,20.32 | C19.1 60.33,40.64 60.33,29.53 63.18,26.67 63.18,20.64 63.5,20.32
  Bottom 1.676: C3.- 90.17,20.32 92.71,17.78
  Bottom 1.93: 77.47,20.32 78.74,20.32 C17.1 C3.- | 77.45,20.3 74.93,20.3 63.5,20.3 63.5,20.32 | X1.3 92.71,6.38 92.71,17.78 99.06,17.78 C10.- 115.57,17.78 115.57,72.39 115.57,96.52 95.63,96.52 Q7.E C21.2

### Text on the board
tPlace: AC-IN | NPN=KSP42 / PNP=KSP92 / Zener=Vout/2 | MOD BY VWV | 1N4007 | 1N4007 | 10 | 0.1uF X2 | RED | RED | KGGR V2.0 With Synchronous Rectifier | 1N4148 | Vout=LT1021 * [ 1+ ( R1/R2 ) ] | LED | + | G | - | + | G | - | + | G | - | + | G | -